# Altium project ESP32C3PHILS.PrjPcb
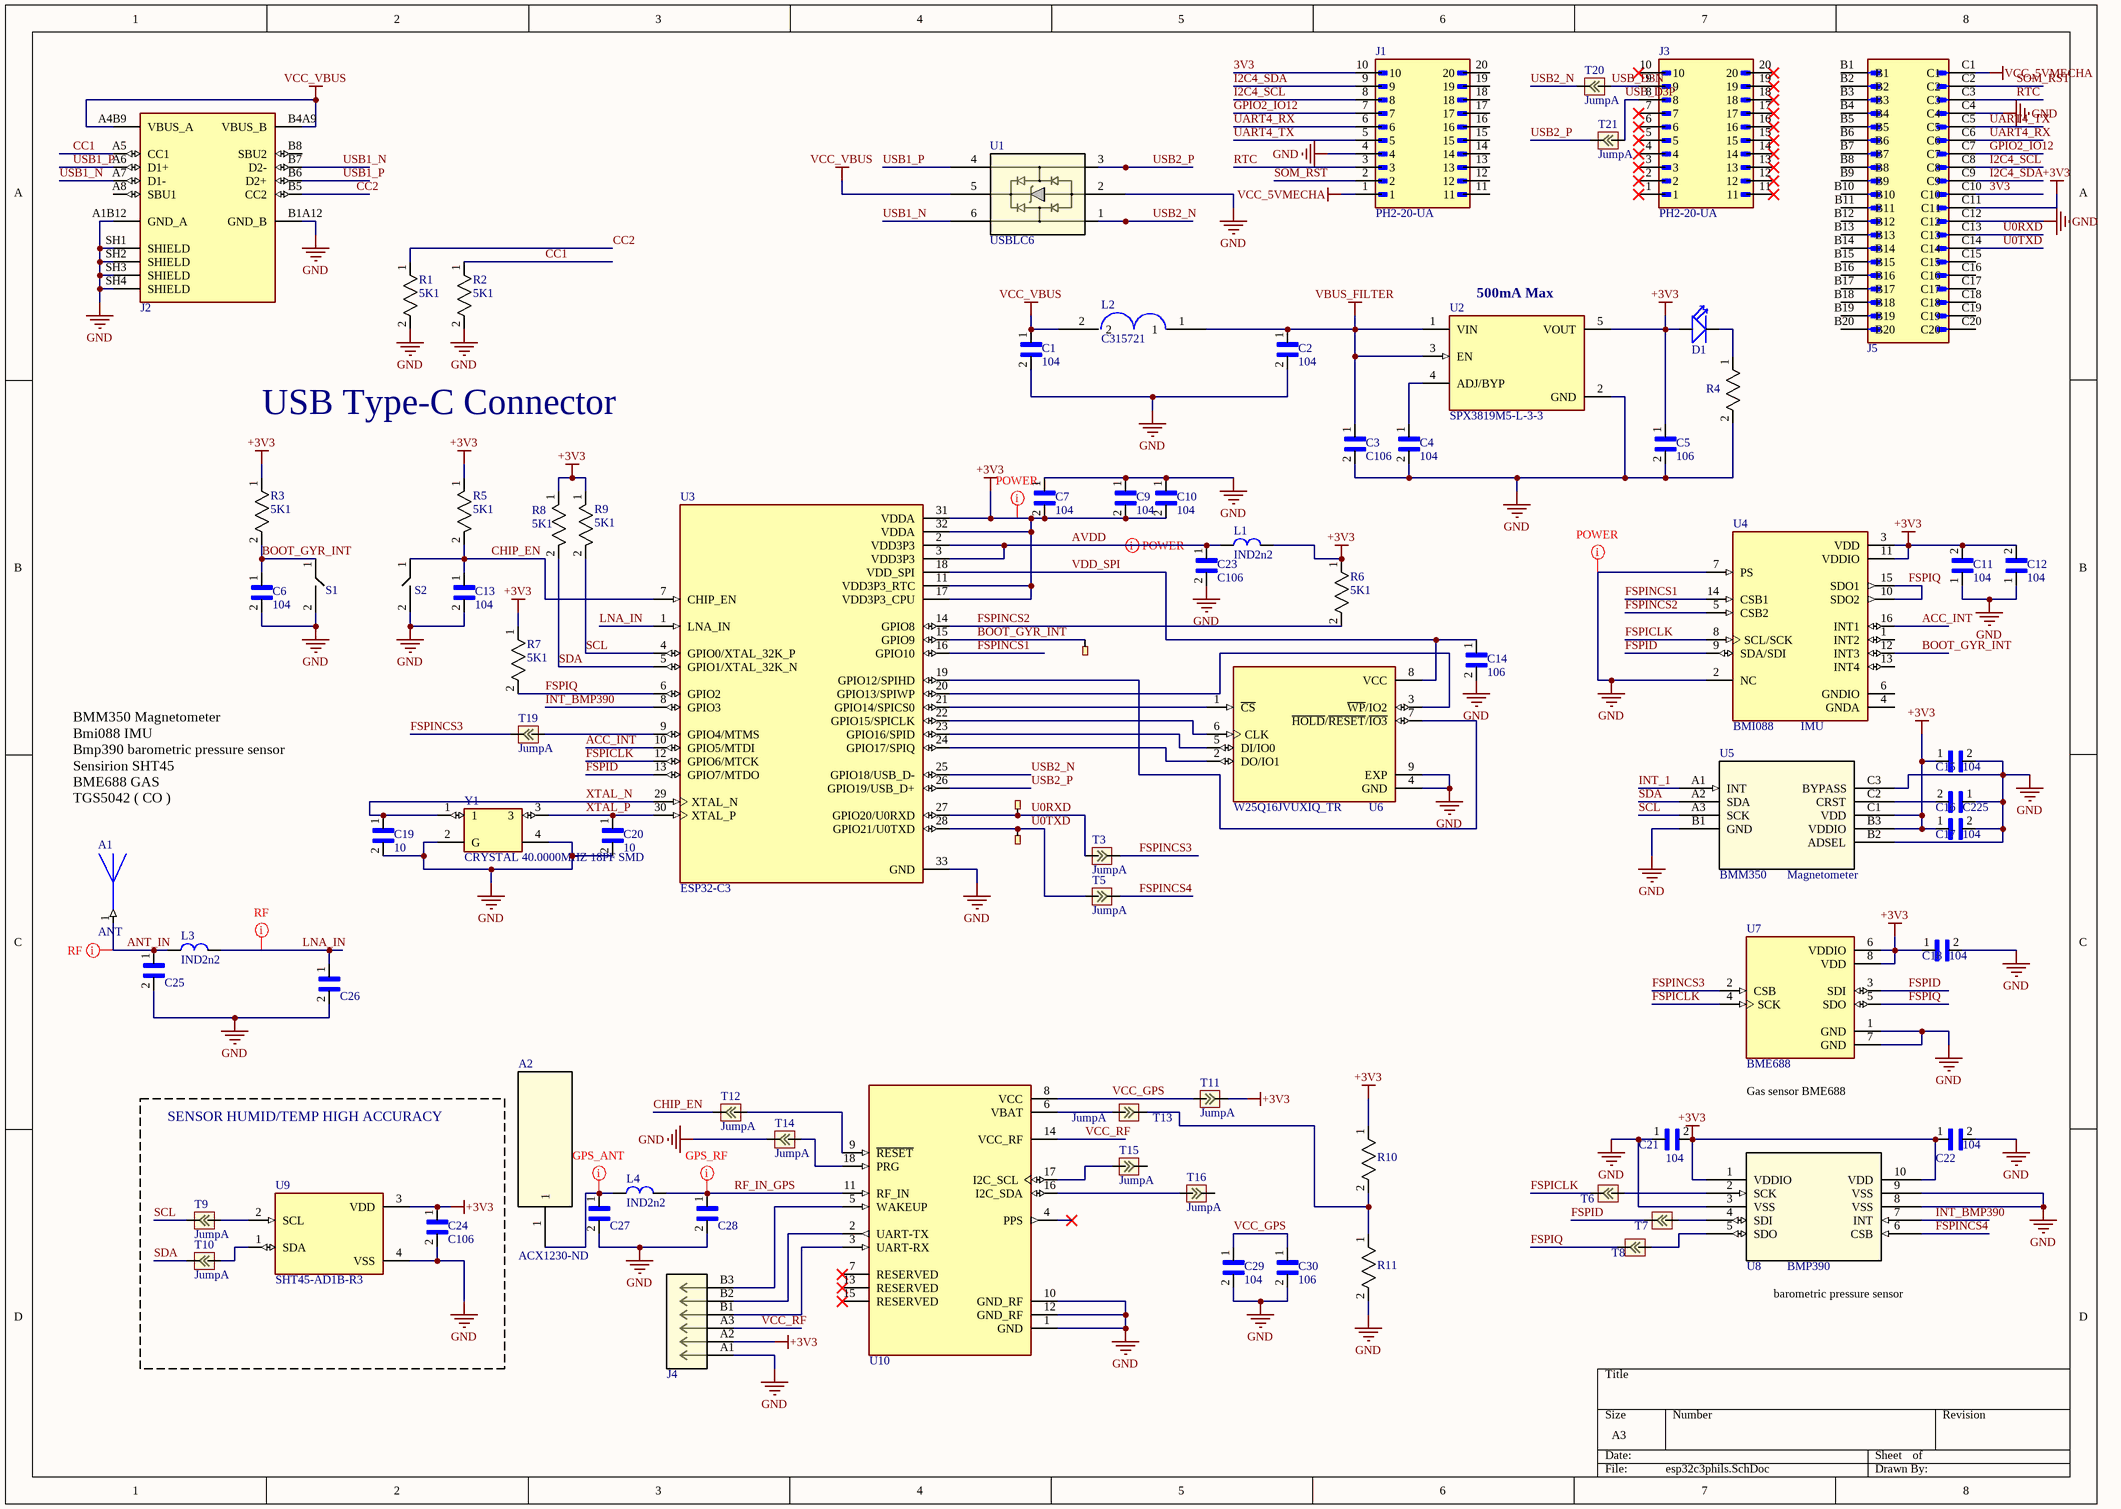
[diagram p0: esp32c3phils.SchDoc]
1 sheet, 84 parts. Net scope: global (net labels, ports and power ports of the same name join across sheets).
Board files: esp32c3phils.PcbDoc, PCB_mecha-io-extension_2025-06-03.pcbdoc

## Sheet esp32c3phils.SchDoc
size A3; SheetNumber: 1; SheetTotal: 1

### Parts
A1  ANT  [XDCR_AMCA31-2R450G-S1F-T3]
A2  Supplier Part Number 1: ACX1230-ND  [SMA_VERTICAL]  (hidden comment: SMA_VERTICAL)
C1  104  [CAPC1005X55N2]
C2  104  [CAPC1005X55N2]
C3  C106  [RC0402]
C4  104  [CAPC1005X55N2]
C5  106  [RC0402]
C6  104  [CAPC1005X55N2]
C7  104  [CAPC1005X55N2]
C9  104  [CAPC1005X55N2]
C10  104  [CAPC1005X55N2]
C11  104  [CAPC1005X55N2]
C12  104  [CAPC1005X55N2]
C13  104  [CAPC1005X55N2]
C14  106  [RC0402]
C15  104  [CAPC1005X55N2]
C16  C225  [RC0402X]
C17  104  [CAPC1005X55N2]
C18  104  [CAPC1005X55N2]
C19  10  [RC0402]
C20  10  [RC0402]
C21  104  [CAPC1005X55N2]
C22  104  [CAPC1005X55N2]
C23  C106  [RC0402]
C24  C106  [RC0402]
C25  GJM1555C1H3R3BB01D  [RC0402]  (value not drawn)
C26  GJM1555C1H3R3BB01D  [RC0402]  (value not drawn)
C27  GJM1555C1H3R3BB01D  [RC0402]  (value not drawn)
C28  GJM1555C1H3R3BB01D  [RC0402]  (value not drawn)
C29  104  [CAPC1005X55N2]
C30  106  [RC0402]
D1  LED  [LEDM1608X80]  (value not drawn)
J1  PH2-20-UA  [HEADERPAD_20_80MIL]
J2  GSB1C411111DS1HR  [AMPHENOL_GSB1C411111DS1HR]  (value not drawn)
J3  PH2-20-UA  [HEADERPAD_20_80MIL]
J4  HEADER6PIN2.54  [HEADER6PIN2.54]  (value not drawn)
J5  HEADER_40PIN_SMD  [AMPHENOL_95157-440LF]  (value not drawn)
L1  IND2n2  [INDC1006X60N]
L2  C315721  [IND-SMD_L2.5-W2.0_SWPA252012S]
L3  IND2n2  [INDC1006X60N]
L4  IND2n2  [INDC1006X60N]
R1  5K1  [RC0402]
R2  5K1  [RC0402]
R3  5K1  [RC0402]
R4  ERA-2AEB202X  [RC0402X]  (value not drawn)
R5  5K1  [RC0402]
R6  5K1  [RC0402]
R7  5K1  [RC0402]
R8  5K1  [RC0402]
R9  5K1  [RC0402]
R10  15K0402  [RC0402X]  (value not drawn)
R11  33K0402  [RC0402X]  (value not drawn)
S1  SW_P  [SW]  (value not drawn)
S2  SW_P  [SW]  (value not drawn)
T1  TP  [TP]  (value not drawn)
T2  TP  [TP]  (value not drawn)
T3  JumpA  [JumpA]
T4  TP  [TP]  (value not drawn)
T5  JumpA  [JumpA]
T6  JumpA  [JumpA]  (value not drawn)
T7  JumpA  [JumpA]  (value not drawn)
T8  JumpA  [JumpA]  (value not drawn)
T9  JumpA  [JumpA]
T10  JumpA  [JumpA]
T11  JumpA  [JumpA]
T12  JumpA  [JumpA]
T13  JumpA  [JumpA]
T14  JumpA  [JumpA]
T15  JumpA  [JumpA]
T16  JumpA  [JumpA]
T19  JumpA  [JumpA]
T20  JumpA  [JumpA]
T21  JumpA  [JumpA]
U1  USBLC6  [SOT23-6L_STM]
U2  SPX3819M5-L-3-3  [SOT95P280X145-5N]
U3  ESP32-C3  [QFN50P500X500X90-33N]
U4  BMI088  [PQFN50P450X300X100-16N]
U5  BMM350  [BGA9_BMM350_BOS]
U6  W25Q16JVUXIQ_TR  [IC_W25Q16JVUXIQ_TR]
U7  BME688  [IC_BME688]
U8  BMP390  [10LGA_2X2X0p75_BOS]
U9  SHT45-AD1B-R3  [SHT4X]
U10  TESEO-LIV4FTR  [XCVR_TESEO-LIV4FTR]  (value not drawn)
Y1  CRYSTAL 40.0000MHZ 18PF SMD  [XTAL_ECS-400-18-33-JGN-TR3]

### Blocks framed on the sheet
SENSOR HUMID/TEMP HIGH ACCURACY: C24 T9 T10 U9

### Nets
+3V3: C5.1 C7.2 C9.2 C10.2 C11.2 C12.2 C15.1 C17.1 C18.1 C21.2 C22.1 C24.1 D1.A J4.A2 J5.C11 L1.2 R3.1 R5.1 R6.1 R7.1 R8.1 R9.1 R10.1 T11.2 U2.5(VOUT) U3.11(VDD3P3_RTC) U3.17(VDD3P3_CPU) U3.31(VDDA) U3.32(VDDA) U4.3(VDD) U4.11(VDDIO) U5.B3(VDDIO) U5.C1(VDD) U7.6(VDDIO) U7.8(VDD) U8.1(VDDIO) U8.10(VDD) U9.3(VDD)
GND: C1.2 C2.2 C3.2 C4.2 C5.2 C6.2 C7.1 C9.1 C10.1 C11.1 C12.1 C13.2 C14.2 C15.2 C16.1 C17.2 C18.2 C19.2 C20.2 C21.1 C22.2 C23.2 C24.2 C25.2 C26.2 C27.2 C28.2 C29.2 C30.2 J1.4 J2.A1B12(GND_A) J2.B1A12(GND_B) J2.SH1(SHIELD) J2.SH2(SHIELD) J2.SH3(SHIELD) J2.SH4(SHIELD) J4.A1 J5.C4 J5.C12 R1.2 R2.2 R4.2 R11.2 S1.2 S2.2 T14.2 U1.2 U2.2(GND) U3.33(GND) U4.2(NC) U4.7(PS) U5.B1(GND) U5.B2(ADSEL) U5.C3(BYPASS) U6.4(GND) U6.9(EXP) U7.1(GND) U7.7(GND) U8.3(VSS) U8.8(VSS) U8.9(VSS) U9.4(VSS) U10.1(GND) U10.10(GND_RF) U10.12(GND_RF) Y1.2(G) Y1.4(G)
VBUS_FILTER: C2.1 C3.1 L2.1 U2.1(VIN) U2.3(EN)
VCC_5VMECHA: J1.1 J5.C1
VCC_VBUS: C1.1 J2.A4B9(VBUS_A) J2.B4A9(VBUS_B) L2.2 U1.5
3V3: J1.10 J5.C10
ACC_INT: U3.10(GPIO5/MTDI) U4.16(INT1)
ANT_IN: A1.1 C25.1 L3.1
AVDD: C23.1 L1.1 U3.2(VDD3P3) U3.3(VDD3P3)
BOOT_GYR_INT: C6.1 R3.2 S1.1 T1.1 U3.15(GPIO9) U4.12(INT3)
CC1: J2.A5(CC1) R2.1
CC2: J2.B5(CC2) R1.1
CHIP_EN: C13.1 R5.2 S2.1 T12.2 U3.7(CHIP_EN)
FSPICLK: T6.2 U3.12(GPIO6/MTCK) U4.8(SCL/SCK) U7.4(SCK)
FSPID: T7.2 U3.13(GPIO7/MTDO) U4.9(SDA/SDI) U7.3(SDI)
FSPINCS1: U3.16(GPIO10) U4.14(CSB1)
FSPINCS2: R6.2 U3.14(GPIO8) U4.5(CSB2)
FSPINCS3: T3.2 T19.2 U7.2(CSB)
FSPINCS4: T5.2 U8.6(CSB)
FSPIQ: R7.2 T8.2 U3.6(GPIO2) U4.10(SDO2) U4.15(SDO1) U7.5(SDO)
GPIO2_IO12: J1.7 J5.C7
I2C4_SCL: J1.8 J5.C8
I2C4_SDA: J1.9 J5.C9
INT_1: U5.A1(INT)
INT_BMP390: U3.8(GPIO3) U8.7(INT)
LNA_IN: C26.1 L3.2 U3.1(LNA_IN)
RF_IN_GPS: C28.1 L4.2 U10.11(RF_IN)
RTC: J1.3 J5.C3
SCL: R9.2 T9.2 U3.4(GPIO0/XTAL_32K_P) U5.A3(SCK)
SDA: R8.2 T10.2 U3.5(GPIO1/XTAL_32K_N) U5.A2(SDA)
SOM_RST: J1.2 J5.C2
U0RXD: J5.C13 T2.1 T3.1 U3.27(GPIO20/U0RXD)
U0TXD: J5.C14 T4.1 T5.1 U3.28(GPIO21/U0TXD)
UART4_RX: J1.6 J5.C6
UART4_TX: J1.5 J5.C5
USB1_N: J2.A7(D1-) J2.B7(D2-) U1.6
USB1_P: J2.A6(D1+) J2.B6(D2+) U1.4
USB2_N: T20.2 U1.1 U3.25(GPIO18/USB_D-)
USB2_P: T21.2 U1.3 U3.26(GPIO19/USB_D+)
USB_D3N: J3.9 T20.1
USB_D3P: J3.8 T21.1
VCC_GPS: C29.1 C30.1 T11.1 U10.8(VCC)
VCC_RF: J4.A3 U10.14(VCC_RF)
VDD_SPI: C14.1 U3.18(VDD_SPI) U6.8(VCC)
XTAL_N: C19.1 U3.29(XTAL_N) Y1.1
XTAL_P: C20.1 U3.30(XTAL_P) Y1.3
NetA2_1: A2.1 C27.1 L4.1
NetC4_1: C4.1 U2.4(ADJ/BYP)
NetC16_2: C16.2 U5.C2(CRST)
NetD1_C: D1.C R4.1
NetJ4_B1: J4.B1 U10.3(UART-RX)
NetJ4_B2: J4.B2 U10.2(UART-TX)
NetJ4_B3: J4.B3 U10.5(WAKEUP)
NetR10_2: R10.2 R11.1 T13.2
NetT6_1: T6.1 U8.2(SCK)
NetT7_1: T7.1 U8.4(SDI)
NetT8_1: T8.1 U8.5(SDO)
NetT9_1: T9.1 U9.2(SCL)
NetT10_1: T10.1 U9.1(SDA)
NetT12_1: T12.1 U10.9(~{RESET})
NetT13_1: T13.1 U10.6(VBAT)
NetT14_1: T14.1 U10.18(PRG)
NetT15_1: T15.1 U10.17(I2C_SCL)
NetT16_1: T16.1 U10.16(I2C_SDA)
NetT19_1: T19.1 U3.9(GPIO4/MTMS)
NetU3_19: U3.19(GPIO12/SPIHD) U6.7(~{HOLD}/~{RESET}/~{IO3})
NetU3_20: U3.20(GPIO13/SPIWP) U6.3(~{WP}/IO2)
NetU3_21: U3.21(GPIO14/SPICS0) U6.1(~{CS})
NetU3_22: U3.22(GPIO15/SPICLK) U6.6(CLK)
NetU3_23: U3.23(GPIO16/SPID) U6.5(DI/IO0)
NetU3_24: U3.24(GPIO17/SPIQ) U6.2(DO/IO1)

Not connected (* = marked no-connect by the designer): J1 11 12 13 14 15 16 17 18 19 20; J2 A8(SBU1) B8(SBU2); J3 1* 2* 3* 4* 5* 6* 7* 10* 11* 12* 13* 14* 15* 16* 17* 18* 19* 20*; J5 B1 B2 B3 B4 B5 B6 B7 B8 B9 B10 B11 B12 B13 B14 B15 B16 B17 B18 B19 B20 C15 C16 C17 C18 C19 C20; T15 2; T16 2; U4 1(INT2) 4(GNDA) 6(GNDIO) 13(INT4); U10 4(PPS)* 7(RESERVED)* 13(RESERVED)* 15(RESERVED)*

### Layout directives
net class RF: ANT_IN, LNA_IN
net class POWER: +3V3, AVDD, GND
mark named GPS_ANT: NetA2_1
mark named GPS_RF: RF_IN_GPS

### Notes on the sheet
- (near U2) 500mA Max
- USB Type-C Connector
- (near U4) IMU
- BMM350 Magnetometer
  Bmi088 IMU
  Bmp390 barometric pressure sensor
  Sensirion SHT45
  BME688 GAS
  TGS5042 ( CO )
- (near U5) Magnetometer
- (near U7) Gas sensor BME688
- (near U8) barometric pressure sensor

### Library data of the parts
A1 = AMCA31-2R450G-S1F-T3: Chip Dielectric Antenna; 1dBi; 2450MHz; T/R | Abracon AMCA31-2R450G-S1F-T3; Manufacturer Part Number: C3283994; Impedance: 50R; Frequency: 2.45GHz; Bandwidth: 90MHz; Power Rating: 3W; Number of Bands: 1; VSWR: 2; Supplier 1: Digikey; Manufacturer: Abracon; RoHS: Yes; Category: RF Antennas; Stock 1: 40750; Pricing 1: 1=0.31, 10=0.217, 25=0.1924, 100=0.1875, 250=0.18412, 500=0.17502, 1000=0.15693 (USD); Mount: Surface Mount; Case/Package: SMD/SMT; Packaging: Tape and Reel; Package Quantity: 3000; Max Power Dissipation: 3W; Termination: Solder; Max Frequency: 2.45GHz; Series: AMCA; Height: 0.047inch; RoHS Compliant: Yes; ComponentLink1URL: https://datasheet.ciiva.com/29647/amca31-2r450g-s1f-t-29647350.pdf?src-supplier=Digikey; ComponentLink1Description: https://datasheet.ciiva.com/29647/amca31-2r450g-s1f-t-29647350.pdf?src-supplier=Digikey; Supplier Part Number 1: 535-14095-1-ND
A2 = SMA_VERTICAL: connector, rf coaxial, sma str jack for p.c.board, 4 legs, .050 center cont, 50 ohm; Manufacturer: Amphenol Connex; Manufacturer Part Number: C3174425; Number of Contacts: 1NUMBER; Supplier 1: Digikey; RoHS: Yes; Category: RF / Coaxial Connectors; Stock 1: 8757; Pricing 1: 1=5.97, 10=5.52, 25=5.362, 50=4.965, 100=4.5941, 300=4.48817, 500=3.66732, 2500=3.43802 (USD); Lead Free: 5697LeadFree; ComponentLink1URL: https://datasheet.ciiva.com/644/132134-644417.pdf?src-supplier=Digikey; ComponentLink1Description: https://datasheet.ciiva.com/644/132134-644417.pdf?src-supplier=Digikey; ComponentLink2URL: https://datasheet.ciiva.com/1118/132134-customer-drawing-1118290.pdf?src-supplier=Newark; ComponentLink2Description: https://datasheet.ciiva.com/1118/132134-customer-drawing-1118290.pdf?src-supplier=Newark; ComponentLink3URL: https://datasheet.ciiva.com/24472/132134-24472891.pdf?src-supplier=Onlinecomponents.com; ComponentLink3Description: https://datasheet.ciiva.com/24472/132134-24472891.pdf?src-supplier=Onlinecomponents.com; ComponentLink4URL: https://datasheet.ciiva.com/8045/1510247-8045022.pdf?src-supplier=Element14; ComponentLink4Description: https://datasheet.ciiva.com/8045/1510247-8045022.pdf?src-supplier=Element14; ComponentLink5URL: https://datasheet.ciiva.com/1116/1510247-1116395.pdf?src-supplier=Element14; ComponentLink5Description: https://datasheet.ciiva.com/1116/1510247-1116395.pdf?src-supplier=Element14; ComponentLink6URL: https://datasheet.ciiva.com/14568/70031837-14568710.pdf?src-supplier=Allied+Electronics; ComponentLink6Description: https://datasheet.ciiva.com/14568/70031837-14568710.pdf?src-supplier=Allied+Electronics
C1 C2 C4 C6 C7 C9-C13 C15 C17 C18 C21 C22 C29 = CC0402KRX7R7BB104: Multilayer Ceramic Capacitor, 0.1 uF, 16 V, ï¿½ 10%, X7R, 0402 [1005 Metric]; Manufacturer: Yageo; Material: 4241ConductorMaterial; Capacitance: 100nF; Voltage Rating: 16V; Temperature Coefficient: 30ppm/°C; Supplier 1: Digikey; Manufacturer Part Number: CC0402KRX7R7BB104; RoHS: Yes; Category: Ceramic Capacitors; Stock 1: 15609894; Pricing 1: 1=0.1, 10=0.024, 50=0.0164, 100=0.0139, 500=0.0098, 1000=0.00852, 2500=0.00718, 5000=0.00636 (USD); Mount: Surface Mount; Case/Package: 0402; Number of Pins: 2; Case Code (Metric): 1005; Case Code (Imperial): 0402; Min Operating Temperature: -55°C; Max Operating Temperature: 125°C; Tolerance: 10%; Voltage Rating (DC): 16V; Packaging: Tape and Reel; Package Quantity: 1; Dielectric: X7R; Termination: SMD/SMT; Voltage: 16V; Series: CC; Voltage Rating (AC): 16V; Length: 1mm; Width: 0.02inch; Height: 0.5mm; Thickness: 0.022inch; Depth: 0.5mm; Radiation Hardening: No; Reach SVHC Compliant: No; RoHS Compliant: Yes; Halogen Free: 5694HalogenFree; Lead Free: 5697LeadFree; ComponentLink1URL: https://datasheet.ciiva.com/11788/0900766b80ce67ed-11788364.pdf?src-supplier=Rs; ComponentLink1Description: https://datasheet.ciiva.com/11788/0900766b80ce67ed-11788364.pdf?src-supplier=Rs; ComponentLink2URL: https://datasheet.ciiva.com/7978/1489800-7978111.pdf?src-supplier=Element14; ComponentLink2Description: https://datasheet.ciiva.com/7978/1489800-7978111.pdf?src-supplier=Element14; ComponentLink3URL: https://datasheet.ciiva.com/161/mlccorderingcode-161545.pdf?src-supplier=Digikey; ComponentLink3Description: https://datasheet.ciiva.com/161/mlccorderingcode-161545.pdf?src-supplier=Digikey; ComponentLink4URL: https://datasheet.ciiva.com/161/mlccorderingcode-161544.pdf?src-supplier=Digikey; ComponentLink4Description: https://datasheet.ciiva.com/161/mlccorderingcode-161544.pdf?src-supplier=Digikey; ComponentLink5URL: https://datasheet.ciiva.com/161/mlccorderingcode-161546.pdf?src-supplier=Digikey; ComponentLink5Description: https://datasheet.ciiva.com/161/mlccorderingcode-161546.pdf?src-supplier=Digikey; ComponentLink6URL: https://datasheet.ciiva.com/8033/1734573-8033661.pdf?src-supplier=Element14; ComponentLink6Description: https://datasheet.ciiva.com/8033/1734573-8033661.pdf?src-supplier=Element14; ComponentLink7URL: https://datasheet.ciiva.com/11587/upy-gphc-x7r-6-3v-to-50v-8-11587305.pdf?src-supplier=Avnet; ComponentLink7Description: https://datasheet.ciiva.com/11587/upy-gphc-x7r-6-3v-to-50v-8-11587305.pdf?src-supplier=Avnet; LCSC: C60474; Supplier Part Number 1: 311-1338-1-ND
C3 C5 C14 C23 C24 C30 = 0402ZD106MAT2A: Multilayer Ceramic Chip Capacitor 0402 Size 10uF 10V X5R ±20% Tolerance SMD T/R; Manufacturer: Kyocera AVX; Manufacturer Part Number: C2167902; Material: 4241ConductorMaterial; Supplier 1: Digikey; RoHS: Yes; Category: Ceramic Capacitors; Stock 1: 61749; Pricing 1: 1=0.36, 10=0.212, 100=0.1271, 1000=0.0834, 2500=0.07583 (USD); Mount: Surface Mount; Case/Package: 0402; Case Code (Imperial): 0402; Case Code (Metric): 1005; Min Operating Temperature: -55°C; Max Operating Temperature: 85°C; Series: -; Packaging: Cut Tape; Dielectric: X5R; Voltage Rating (DC): 10V; Capacitance: 10uF; Tolerance: 20%; Voltage Rating: 10V; Height: 710um; RoHS Compliant: Yes; ComponentLink1URL: http://catalogs.avx.com/SurfaceMount.pdf?src-supplier=Digikey; ComponentLink1Description: http://catalogs.avx.com/SurfaceMount.pdf?src-supplier=Digikey; ComponentLink2URL: http://datasheets.avx.com/cx5r.pdf?src-supplier=Digikey; ComponentLink2Description: http://datasheets.avx.com/cx5r.pdf?src-supplier=Digikey; ComponentLink3URL: https://datasheet.octopart.com/0402ZD106MAT2A-KYOCERA-AVX-datasheet-155912759.pdf?src-supplier=Future+Electronics; ComponentLink3Description: https://datasheet.octopart.com/0402ZD106MAT2A-KYOCERA-AVX-datasheet-155912759.pdf?src-supplier=Future+Electronics; ComponentLink4URL: https://www.farnell.com/datasheets/2260752.pdf?src-supplier=Newark; ComponentLink4Description: https://www.farnell.com/datasheets/2260752.pdf?src-supplier=Newark; ComponentLink5URL: https://datasheet.octopart.com/0402ZD106MAT2A-KYOCERA-AVX-datasheet-155912759.pdf?src-supplier=TME; ComponentLink5Description: https://datasheet.octopart.com/0402ZD106MAT2A-KYOCERA-AVX-datasheet-155912759.pdf?src-supplier=TME; Supplier Part Number 1: 478-KGM05CR51A106MHCT-ND
C16 = C225: Multilayer Ceramic Capacitor, 2.2 uF, 6.3 V, ï¿½ 20%, X5R, 0402 [1005 Metric]; Manufacturer: Samsung; Manufacturer Part Number: CL05A225MQ5NNNC; Capacitance: 2.2uF; Voltage Rating: 6.3V; Supplier 1: Digikey; RoHS: Yes; Category: Ceramic Capacitors; Stock 1: 23507; Pricing 1: 1=0.08, 10=0.011, 100=0.0064, 1000=0.0048, 2500=0.0032 (USD); Mount: Surface Mount; Case/Package: 0402; Case Code (Metric): 1005; Case Code (Imperial): 0402; Material: Ceramic; Min Operating Temperature: -55°C; Max Operating Temperature: 85°C; Packaging: Tape and Reel; Tolerance: 20%; Dielectric: X5R; Series: CL; Construction: Flat; Voltage Rating (DC): 6.3V; Length: 1mm; Height: 0.5mm; Depth: 0.5mm; Radiation Hardening: No; RoHS Compliant: Yes; ComponentLink1URL: https://datasheet.ciiva.com/25798/cl05a225mq5nnnc-25798545.pdf?src-supplier=Digikey; ComponentLink1Description: https://datasheet.ciiva.com/25798/cl05a225mq5nnnc-25798545.pdf?src-supplier=Digikey; ComponentLink2URL: https://datasheet.ciiva.com/16437/cl05a225mq5nnnc-16437362.pdf?src-supplier=Future+Electronics; ComponentLink2Description: https://datasheet.ciiva.com/16437/cl05a225mq5nnnc-16437362.pdf?src-supplier=Future+Electronics; Supplier Part Number 1: 1276-1469-1-ND
C19 C20 = C10: 0402 10 pF 50 V ±5 % Tolerance NP0 SMT Multilayer Ceramic Capacitor; Manufacturer: Yageo; Manufacturer Part Number: CC0402JRNPO9BN100; Dielectric Material: 4241ConductorMaterial; Capacitance: 10pF; Tolerance: 5%; Voltage Rating: 50V; Dielectric: C0G; Temperature Coefficient: 30ppm/°C; Insulation Resistance: 100GR; Supplier 1: Digikey; RoHS: Yes; Category: Ceramic Capacitors; Stock 1: 1109319; Pricing 1: 1=0.1, 10=0.024, 100=0.0133, 1000=0.00812, 2500=0.00685, 5000=0.00609 (USD); Mount: Surface Mount; Case/Package: 0402; Number of Pins: 2; Case Code (Metric): 1005; Case Code (Imperial): 0402; Min Operating Temperature: -55°C; Max Operating Temperature: 125°C; Packaging: Tape and Reel; Voltage Rating (DC): 50V; Package Quantity: 1; Termination: SMD/SMT; Voltage: 50V; Series: CC; Voltage Rating (AC): 50V; Length: 1mm; Width: 0.02inch; Height: 0.5mm; Thickness: 0.022inch; Depth: 0.5mm; Radiation Hardening: No; Reach SVHC Compliant: No; Lead Free: Lead Free; RoHS Compliant: Yes; Halogen Free: 5694HalogenFree; ComponentLink1URL: https://datasheet.ciiva.com/11786/0900766b8079c870-11786158.pdf?src-supplier=Rs; ComponentLink1Description: https://datasheet.ciiva.com/11786/0900766b8079c870-11786158.pdf?src-supplier=Rs; ComponentLink2URL: https://datasheet.ciiva.com/143/mlccorderingcode-143992.pdf?src-supplier=Digikey; ComponentLink2Description: https://datasheet.ciiva.com/143/mlccorderingcode-143992.pdf?src-supplier=Digikey; ComponentLink3URL: https://datasheet.ciiva.com/143/mlccorderingcode-143993.pdf?src-supplier=Digikey; ComponentLink3Description: https://datasheet.ciiva.com/143/mlccorderingcode-143993.pdf?src-supplier=Digikey; ComponentLink4URL: https://datasheet.ciiva.com/143/mlccorderingcode-143994.pdf?src-supplier=Digikey; ComponentLink4Description: https://datasheet.ciiva.com/143/mlccorderingcode-143994.pdf?src-supplier=Digikey; ComponentLink5URL: https://datasheet.ciiva.com/8033/1443161-8033591.pdf?src-supplier=Element14; ComponentLink5Description: https://datasheet.ciiva.com/8033/1443161-8033591.pdf?src-supplier=Element14; ComponentLink6URL: https://datasheet.ciiva.com/8033/1443161-8033593.pdf?src-supplier=Element14; ComponentLink6Description: https://datasheet.ciiva.com/8033/1443161-8033593.pdf?src-supplier=Element14; ComponentLink7URL: https://datasheet.ciiva.com/8033/1443161-8033596.pdf?src-supplier=Element14; ComponentLink7Description: https://datasheet.ciiva.com/8033/1443161-8033596.pdf?src-supplier=Element14; ComponentLink8URL: https://datasheet.ciiva.com/28450/1443161-28450213.pdf?src-supplier=Element14; ComponentLink8Description: https://datasheet.ciiva.com/28450/1443161-28450213.pdf?src-supplier=Element14; ComponentLink9URL: https://datasheet.ciiva.com/5427/upy-gp-np0-16v-to-50v-8-5427741.pdf?src-supplier=Mouser; ComponentLink9Description: https://datasheet.ciiva.com/5427/upy-gp-np0-16v-to-50v-8-5427741.pdf?src-supplier=Mouser; Supplier Part Number 1: 311-1014-1-ND
C25-C28 = 3.3PF0402LCSC: Multilayer Ceramic Capacitors MLCC - SMD/SMT 0402 3.3pF 50Volts C0G +/-0.1pF; Manufacturer: Murata; Manufacturer Part Number: C76906; Voltage Rating: 50V; Temperature Coefficient: 30ppm/°C; Supplier 1: Digikey; RoHS: Yes; Category: Ceramic Capacitors; Stock 1: 2577; Pricing 1: 1=0.12, 10=0.065, 100=0.039, 1000=0.02419, 2500=0.02076, 5000=0.02051 (USD); Mount: Surface Mount; Case/Package: 0402; Number of Pins: 2; Case Code (Metric): 1005; Case Code (Imperial): 0402; Material: Ceramic; Min Operating Temperature: -55°C; Max Operating Temperature: 125°C; Capacitance: 3.3pF; Package Quantity: 1; Packaging: Tape and Reel; Voltage Rating (DC): 50V; Dielectric: C0G; Termination: SMD/SMT; Voltage: 50V; Series: GJM; Construction: Flat; Length: 1mm; Width: 0.5mm; Height: 0.5mm; Thickness: 0.022inch; Depth: 0.5mm; Lead Pitch: 0.3mm; Radiation Hardening: No; Reach SVHC Compliant: No; Lead Free: Lead Free; RoHS Compliant: Yes; ComponentLink1URL: https://datasheet.ciiva.com/11614/product-11614199.pdf?src-supplier=Avnet; ComponentLink1Description: https://datasheet.ciiva.com/11614/product-11614199.pdf?src-supplier=Avnet; ComponentLink2URL: https://datasheet.ciiva.com/8030/1700175-8030120.pdf?src-supplier=Element14; ComponentLink2Description: https://datasheet.ciiva.com/8030/1700175-8030120.pdf?src-supplier=Element14; Supplier Part Number 1: 490-8097-1-ND
D1 = LTST-C190KFKT: Single Color LED, Ultra Bright Orange, Water Clear, 1.1mm; Manufacturer: Vishay Lite-On; Manufacturer Part Number: C157740; Lens Color: Colorless; Power Rating: 75mW; Luminous Intensity: 90mcd; Viewing Angle: 130°; Forward Current: 30mA; Forward Voltage: 2V; Lens Style: Flat,Diffused,Colorless,Rectangular,Clear; Dominant Wavelength: 605nm; Test Current: 20mA; Number of Elements: 1; Reverse Voltage: 5V; Voltage Rating: 50V; Resistance: 47kR; Tolerance: 1%; Lens Size: 0.8mm; Supplier 1: Digikey; RoHS: Yes; Category: LEDs; Stock 1: 96032; Pricing 1: 1=0.13, 10=0.089, 100=0.0613, 500=0.0484, 1000=0.0441, 2000=0.04042 (USD); Mount: Surface Mount; Case/Package: 0603; Number of Pins: 2; Color: Orange; Case Code (Metric): 1608; Case Code (Imperial): 0603; Min Operating Temperature: -55°C; Max Operating Temperature: 85°C; Packaging: Tape and Reel; Package Quantity: 3000; Illumination Color: Orange; Lens Transparency: Clear; Power Dissipation: 75mW; Wavelength: 605nm; Number of LEDs: 1; Series: -; Voltage Rating (DC): 50V; Length: 3.2mm; Width: 0.8mm; Height: 0.9mm; Depth: 1.6mm; Radiation Hardening: No; Lead Free: Lead Free; RoHS Compliant: Yes; Reach SVHC Compliant: 4186SVHC; ComponentLink1URL: https://datasheet.ciiva.com/11774/0900766b80dc02a7-11774744.pdf?src-supplier=Rs; ComponentLink1Description: https://datasheet.ciiva.com/11774/0900766b80dc02a7-11774744.pdf?src-supplier=Rs; ComponentLink2URL: https://datasheet.ciiva.com/15201/getdatasheetpartid-309341-15201388.pdf?src-supplier=Verical; ComponentLink2Description: https://datasheet.ciiva.com/15201/getdatasheetpartid-309341-15201388.pdf?src-supplier=Verical; ComponentLink3URL: https://datasheet.ciiva.com/16396/lite-on20ltst-c190kfkt-16396246.pdf?src-supplier=Future+Electronics; ComponentLink3Description: https://datasheet.ciiva.com/16396/lite-on20ltst-c190kfkt-16396246.pdf?src-supplier=Future+Electronics; ComponentLink4URL: https://datasheet.ciiva.com/12400/100-ltst-c190kfkt-53640-12400769.pdf?src-supplier=Mouser; ComponentLink4Description: https://datasheet.ciiva.com/12400/100-ltst-c190kfkt-53640-12400769.pdf?src-supplier=Mouser; ComponentLink5URL: https://datasheet.ciiva.com/2109/s-110-ltst-c190kfkt-2109976.pdf?src-supplier=Digikey; ComponentLink5Description: https://datasheet.ciiva.com/2109/s-110-ltst-c190kfkt-2109976.pdf?src-supplier=Digikey; ComponentLink6URL: https://datasheet.ciiva.com/2109/s-110-ltst-c190kfkt-2109977.pdf?src-supplier=Digikey; ComponentLink6Description: https://datasheet.ciiva.com/2109/s-110-ltst-c190kfkt-2109977.pdf?src-supplier=Digikey; ComponentLink7URL: https://datasheet.ciiva.com/2109/s-110-ltst-c190kfkt-2109978.pdf?src-supplier=Digikey; ComponentLink7Description: https://datasheet.ciiva.com/2109/s-110-ltst-c190kfkt-2109978.pdf?src-supplier=Digikey; Supplier Part Number 1: 160-1434-1-ND
J1 J3 = PH2-20-UA: MF: {'manufacturer': u'Adam Tech'}; Package: None; Price: None; Value: *; MP: PH2-20-UA; Availability: Unavailable
J2 = USB-C RECP B: USB2.0, Type C, Top mount, Center Height 1.68mm, Single Row Surface Mount; Manufacturer: Amphenol; Supplier 1: Digikey; Manufacturer Part Number: GSB1C411111DS1HR; RoHS: No; Category: Connectors; Stock 1: 7439; Pricing 1: 1=0.81, 10=0.686, 25=0.6428, 50=0.6122, 100=0.5829, 250=0.54632, 500=0.52024 (USD); Supplier Part Number 1: 664-GSB1C411111DS1HRCT-ND; LCSC Part#: C3197888
J4 = HEADER6PIN2.54: Conn Unshrouded Header HDR 6 POS 2.54mm Solder ST Top Entry SMD C-Grid Bag; Manufacturer: Molex; Manufacturer Part Number: C780054; Plating: Tin; Max Voltage Rating (DC): 250.25kV; Current Rating: 3A; Voltage Rating: 250V; Number of Positions: 6; Gender: Male; Number of Circuits: 4; Glow Wire Compliant: Non-compliant; Supplier 1: Digikey; RoHS: Yes; Category: Headers and Wire Housings; Stock 1: 16474; Pricing 1: 1=0.52, 10=0.445, 100=0.3781, 500=0.33748, 3000=0.29738, 6000=0.28319, 12000=0.26968 (USD); Mount: Surface Mount; Contact Plating: Gold; Contact Material: Bronze; Housing Color: Black; Material: Bronze; Housing Material: Thermoplastic; Min Operating Temperature: -40°C; Max Operating Temperature: 105°C; Number of Rows: 2; Package Quantity: 3000; Contact Gender: Male; Packaging: Bulk; Termination: SMD/SMT; Number of Contacts: 6; Orientation: Straight; Voltage Rating (DC): 250V; Series: 71308; Pitch: 2.54mm; Row Spacing: 2.54mm; ELV: Compliant; Halogen Free: Low Halogen; Lead Free: Lead Free; Flammability Rating: UL94 V-0; RoHS Compliant: Yes; Reach SVHC Compliant: Unknown; ComponentLink1URL: https://datasheet.octopart.com/15-91-0060-Molex-datasheet-164461481.pdf?src-supplier=Sager+Electronics; ComponentLink1Description: https://datasheet.octopart.com/15-91-0060-Molex-datasheet-164461481.pdf?src-supplier=Sager+Electronics; ComponentLink2URL: https://datasheet.octopart.com/15-91-0060-Molex-datasheet-154743765.pdf?src-supplier=Master+Electronics; ComponentLink2Description: https://datasheet.octopart.com/15-91-0060-Molex-datasheet-154743765.pdf?src-supplier=Master+Electronics; Supplier Part Number 1: WM17457-ND
J5 = HEADER_40PIN_SMD: Conn Unshrouded Header HDR 40 POS 2.54mm Solder ST Top Entry SMD Bulk; Manufacturer: Amphenol ICC / FCI; Manufacturer Part Number: C6332245; Current Rating: 3A; Voltage Rating: 1.5kV; Number of Positions: 40; Insulation Resistance: 5GR; Gender: Male; Row Spacing: 0.1inch; Contact Post Length: 4.7mm; Supplier 1: Digikey; RoHS: Yes; Category: Headers and Wire Housings; Stock 1: 2650; Pricing 1: 1=1.53, 10=1.296, 100=1.1013, 600=0.97043, 1200=0.92412, 5400=0.83112, 10200=0.79469 (USD); Mount: Surface Mount; Contact Plating: Tin,Gold; Contact Material: Bronze; Color: Black; Housing Color: Black; Housing Material: Thermoplastic; Min Operating Temperature: -65°C; Max Operating Temperature: 125°C; Number of Rows: 2; Contact Gender: Male; Termination: Solder; Number of Contacts: 40; Max Voltage Rating (AC): 1.5kV; Orientation: Straight; Package Quantity: 100; Packaging: Bulk; Series: BERGSTIK® II, MezzSelect™, Basics+; Contact Type: Male Pin; Length: 50.8mm; Pitch: 2.54mm; Contact Mating Length: 0.23inch; Depth: 4.83mm; Reach SVHC Compliant: No; Flammability Rating: UL94 V-0; ComponentLink1URL: https://datasheet.ciiva.com/726/95157-726825.pdf?src-supplier=Digikey; ComponentLink1Description: https://datasheet.ciiva.com/726/95157-726825.pdf?src-supplier=Digikey; ComponentLink2URL: https://datasheet.ciiva.com/10113/95157-10113738.pdf?src-supplier=Avnet; ComponentLink2Description: https://datasheet.ciiva.com/10113/95157-10113738.pdf?src-supplier=Avnet; ComponentLink3URL: https://datasheet.ciiva.com/5155/95157-101776-5155834.pdf?src-supplier=Mouser; ComponentLink3Description: https://datasheet.ciiva.com/5155/95157-101776-5155834.pdf?src-supplier=Mouser; Supplier Part Number 1: 609-3124-ND
L1 = IND2n2: Inductor with Inductance: 2.2nH Tol. +/-0.1nH, Package: 0402 (1005); MF: Murata Electronics; MP: LQW15AN2N2B80D; Package: 1006 Murata; Check_prices: https://www.snapeda.com/parts/LQW15AN2N2B80D/Murata%20Electronics%20North%20America/view-part/1522880/?ref=eda; Availability: Good; Value: *; Purchase-URL: https://pricing.snapeda.com/search/part/LQW15AN2N2B80D/?ref=eda; Price: None; SnapEDA_Link: https://www.snapeda.com/parts/LQW15AN2N2B80D/Murata%20Electronics%20North%20America/view-part/1522880/?ref=snap; Manufacturer Part Number: LQW15AN2N2B80D
L2 = SPH252010H2R2MT: Fixed Ind 2.220%UH 0.114 Ohm 1800; Manufacturer: Sunlord; Supplier 1: Digikey; Manufacturer Part Number: C315721; RoHS: Yes; Category: Fixed Inductors; Stock 1: 1953; Pricing 1: 1=0.27, 10=0.207, 25=0.1872, 50=0.1736, 100=0.1609, 250=0.14548, 500=0.13478, 1000=0.125 (USD); RoHS Compliant: Yes; Supplier Part Number 1: 3442-SPH252010H2R2MTCT-ND
L3 L4 = IND2n2: Inductor with Inductance: 2.2nH Tol. +/-0.1nH, Package: 0402 (1005); Manufacturer Part Number: C2041833; MF: Murata Electronics; MP: LQW15AN2N2B80D; Package: 1006 Murata; Check_prices: https://www.snapeda.com/parts/LQW15AN2N2B80D/Murata%20Electronics%20North%20America/view-part/1522880/?ref=eda; Availability: Good; Value: *; Purchase-URL: https://pricing.snapeda.com/search/part/LQW15AN2N2B80D/?ref=eda; Price: None; SnapEDA_Link: https://www.snapeda.com/parts/LQW15AN2N2B80D/Murata%20Electronics%20North%20America/view-part/1522880/?ref=snap
R1-R3 R5-R9 = RC0402FR-075K1L: SMD Chip Resistor, 5.1 kOhm, ï¿½ 1%, 62.5 mW, 0402 [1005 Metric], Thick Film, General Purpose; Manufacturer: Yageo; Manufacturer Part Number: C105872; Power Rating: 63mW; Voltage Rating: 50V; Resistance: 5.1kR; Temperature Coefficient: 100ppm/°C; Supplier 1: Digikey; RoHS: Yes; Category: Chip SMD Resistors; Stock 1: 868211; Pricing 1: 1=0.1, 10=0.009, 50=0.0072, 100=0.0041, 500=0.00306 (USD); Case/Package: 0402; Case Code (Metric): 1005; Case Code (Imperial): 0402; Min Operating Temperature: -55°C; Max Operating Temperature: 155°C; Tolerance: 1%; Packaging: Tape and Reel; Package Quantity: 1; Resistor Type: Thick Film; Number of Terminations: 2; Termination: SMD/SMT; Max Power Dissipation: 63mW; Features: Moisture Resistant; Series: RC; Resistance Tolerance: 1%; Technology: THICK FILM; Voltage Rating (DC): 50V; Working Voltage: 50V; Construction: Rectangular; Length: 1mm; Width: 0.02inch; Height: 0.016inch; Depth: 0.5mm; RoHS Compliant: Yes; Reach SVHC Compliant: Unknown; Lead Free: 5697LeadFree; Military Standard: Not; Supplier Part Number 1: 311-5.10KLRCT-ND; LCSC: C105872
R4 = 2K2: Res Thin Film 0402 2K Ohm 0.1% 0.063W ±25ppm/°C Molded SMD Punched Carrier T/R; Manufacturer: Panasonic; Manufacturer Part Number: ERA2AEB202X; Resistance: 2kR; Power Rating: 63mW; Voltage Rating: 25V; Supplier 1: Digikey; RoHS: Yes; Category: Chip SMD Resistors; Stock 1: 90625; Pricing 1: 1=0.1, 10=0.082, 50=0.0716, 100=0.0677, 500=0.05944, 1000=0.05637, 5000=0.05032 (USD); Mount: Surface Mount; Case/Package: 0402; Case Code (Metric): 1005; Case Code (Imperial): 0402; Contact Plating: Tin; Size Code: 0402; Min Operating Temperature: -55°C; Max Operating Temperature: 155°C; Tolerance: 0.1%; Packaging: Tape and Reel; Package Quantity: 1; Resistor Type: Thin Film,Metal Film; Number of Terminations: 2; Termination: SMD/SMT; Temperature Coefficient: 25ppm/°C; Max Power Dissipation: 63mW; Features: Automotive AEC-Q200; Series: ERA-2A; Resistance Tolerance: 0.1%; Technology: THIN FILM; Length: 1mm; Width: 0.5mm; Height: 0.35mm; Depth: 0.5mm; Radiation Hardening: No; Reach SVHC Compliant: No; Lead Free: Lead Free; RoHS Compliant: Yes; ComponentLink1URL: https://datasheet.ciiva.com/43470/1776116-43470486.pdf?src-supplier=Farnell; ComponentLink1Description: https://datasheet.ciiva.com/43470/1776116-43470486.pdf?src-supplier=Farnell; ComponentLink2URL: https://datasheet.ciiva.com/9116/aoa0000ce26-9116653.pdf?src-supplier=Avnet; ComponentLink2Description: https://datasheet.ciiva.com/9116/aoa0000ce26-9116653.pdf?src-supplier=Avnet; ComponentLink3URL: https://datasheet.ciiva.com/9197/aoa0000ce26-9197535.pdf?src-supplier=Avnet; ComponentLink3Description: https://datasheet.ciiva.com/9197/aoa0000ce26-9197535.pdf?src-supplier=Avnet; Supplier Part Number 1: P2.0KDCCT-ND
R10 = 15K0402: Res Thin Film 0402 15K Ohm 0.1% 0.063W(1/16W) ±25ppm/C Pad SMD T/R; Manufacturer: Yageo; Manufacturer Part Number: C852545; Voltage Rating: 50V; Resistance: 15kR; Power Rating: 62.5mW; Max Power Dissipation: 63mW; Temperature Coefficient: 25ppm/°C; Supplier 1: Digikey; RoHS: Yes; Category: Chip SMD Resistors; Stock 1: 36293; Pricing 1: 1=0.17, 10=0.116, 50=0.1, 100=0.0877, 500=0.06834, 1000=0.06018, 5000=0.04488 (USD); Case/Package: 0402; Case Code (Imperial): 0402; Case Code (Metric): 1005; Size Code: 0402; Min Operating Temperature: -55°C; Max Operating Temperature: 155°C; Tolerance: 0.1%; Number of Terminations: 2; Termination: SMD/SMT; Voltage Rating (DC): 50V; Features: Moisture Resistant; Packaging: Tape and Reel; Package Quantity: 10000; Series: RT; Length: 0.039inch; Width: 0.02inch; Height: 0.014inch; Lead Free: Lead Free; RoHS Compliant: Yes; ComponentLink1URL: https://datasheet.ciiva.com/2582/pyu-rt-1-to-0-05-rohs-l-5-2582151.pdf?src-supplier=Digikey; ComponentLink1Description: https://datasheet.ciiva.com/2582/pyu-rt-1-to-0-05-rohs-l-5-2582151.pdf?src-supplier=Digikey; ComponentLink2URL: https://datasheet.ciiva.com/12723/pyu-rt-1-to-0-05-rohs-l-4-12723782.pdf?src-supplier=Mouser; ComponentLink2Description: https://datasheet.ciiva.com/12723/pyu-rt-1-to-0-05-rohs-l-4-12723782.pdf?src-supplier=Mouser; Supplier Part Number 1: YAG2302CT-ND
R11 = 33K0402: SMD Chip Resistor, 33 Kohm, ½ 5%, 62.5 Mw, 0402 [1005 Metric], Thick Film, General Purpose; Manufacturer: Yageo; Manufacturer Part Number: C138003; Resistance: 33kR; Power Rating: 62.5mW; Voltage Rating: 50V; Temperature Coefficient: 100ppm/°C; Max Power Dissipation: 63mW; Supplier 1: Digikey; RoHS: Yes; Category: Chip SMD Resistors; Stock 1: 242382; Pricing 1: 1=0.1, 10=0.007, 50=0.0066, 100=0.0061, 500=0.0051, 1000=0.00408, 5000=0.00306 (USD); Case/Package: 0402; Case Code (Imperial): 0402; Case Code (Metric): 1005; Min Operating Temperature: -55°C; Max Operating Temperature: 155°C; Tolerance: 5%; Packaging: Tape and Reel; Termination: SMD/SMT; Resistor Type: Thick Film; Number of Terminations: 2; Features: Moisture Resistant; Series: RC; Resistance Tolerance: 5%; Voltage Rating (AC): 50V; Working Voltage: 50V; Construction: Rectangular; Technology: THICK FILM; Length: 1mm; Depth: 0.5mm; Reach SVHC Compliant: No; Lead Free: Lead Free; RoHS Compliant: Yes; Military Standard: Not; ComponentLink1URL: https://datasheet.ciiva.com/16740/pyu-rc0402-51-rohs-l-6-r-16740743.pdf?src-supplier=Future+Electronics; ComponentLink1Description: https://datasheet.ciiva.com/16740/pyu-rc0402-51-rohs-l-6-r-16740743.pdf?src-supplier=Future+Electronics; ComponentLink2URL: https://datasheet.ciiva.com/7983/1018594-7983578.pdf?src-supplier=Element14; ComponentLink2Description: https://datasheet.ciiva.com/7983/1018594-7983578.pdf?src-supplier=Element14; ComponentLink3URL: https://datasheet.ciiva.com/7850/1018594-7850198.pdf?src-supplier=Element14; ComponentLink3Description: https://datasheet.ciiva.com/7850/1018594-7850198.pdf?src-supplier=Element14; ComponentLink4URL: https://datasheet.ciiva.com/7850/1018594-7850199.pdf?src-supplier=Element14; ComponentLink4Description: https://datasheet.ciiva.com/7850/1018594-7850199.pdf?src-supplier=Element14; ComponentLink5URL: https://datasheet.ciiva.com/5558/pyu-rc0402-51-rohs-l-6-r-5558154.pdf?src-supplier=Mouser; ComponentLink5Description: https://datasheet.ciiva.com/5558/pyu-rc0402-51-rohs-l-6-r-5558154.pdf?src-supplier=Mouser; Supplier Part Number 1: 311-33KJRCT-ND
S1 S2 = SW_P: Switch Tactile N.O. SPST Round Button Gull Wing 0.05A 12VDC 0.98N SMD T/R; Manufacturer: Alps Electric; Manufacturer Part Number: C202388; Supplier 1: Digikey; RoHS: Yes; Category: Tactile Switches; Stock 1: 19659; Pricing 1: 1=0.41, 10=0.351, 25=0.3276, 100=0.2931, 250=0.27156, 500=0.2563, 1000=0.24208 (USD); RoHS Compliant: Yes; ComponentLink1URL: http://datasheet.octopart.com/SKRKAHE020-ALPS-datasheet-41327033.pdf?src-supplier=Farnell; ComponentLink1Description: http://datasheet.octopart.com/SKRKAHE020-ALPS-datasheet-41327033.pdf?src-supplier=Farnell; ComponentLink2URL: http://datasheet.octopart.com/SKRKAHE020-ALPS-datasheet-41327033.pdf?src-supplier=Avnet; ComponentLink2Description: http://datasheet.octopart.com/SKRKAHE020-ALPS-datasheet-41327033.pdf?src-supplier=Avnet; ComponentLink3URL: http://datasheet.octopart.com/SKRKAHE020-ALPS-datasheet-41327033.pdf?src-supplier=Onlinecomponents.com; ComponentLink3Description: http://datasheet.octopart.com/SKRKAHE020-ALPS-datasheet-41327033.pdf?src-supplier=Onlinecomponents.com; ComponentLink4URL: http://datasheet.octopart.com/SKRKAHE020-ALPS-datasheet-41327033.pdf?src-supplier=Verical; ComponentLink4Description: http://datasheet.octopart.com/SKRKAHE020-ALPS-datasheet-41327033.pdf?src-supplier=Verical; ComponentLink5URL: http://datasheet.octopart.com/SKRKAHE020-ALPS-datasheet-41327033.pdf?src-supplier=Future+Electronics; ComponentLink5Description: http://datasheet.octopart.com/SKRKAHE020-ALPS-datasheet-41327033.pdf?src-supplier=Future+Electronics; ComponentLink6URL: https://datasheet.octopart.com/SKRKAHE020-ALPS-datasheet-156009340.pdf?src-supplier=Electro+Sonic; ComponentLink6Description: https://datasheet.octopart.com/SKRKAHE020-ALPS-datasheet-156009340.pdf?src-supplier=Electro+Sonic; ComponentLink7URL: http://datasheet.octopart.com/SKRKAHE020-ALPS-datasheet-41327033.pdf?src-supplier=Quest; ComponentLink7Description: http://datasheet.octopart.com/SKRKAHE020-ALPS-datasheet-41327033.pdf?src-supplier=Quest; ComponentLink8URL: https://datasheet.octopart.com/SKRKAHE020-ALPS-datasheet-41327033.pdf?src-supplier=Master+Electronics; ComponentLink8Description: https://datasheet.octopart.com/SKRKAHE020-ALPS-datasheet-41327033.pdf?src-supplier=Master+Electronics; Supplier Part Number 1: 4809-SKRKAHE020CT-ND
U1 = USBLC6-2SC6: ESD Suppressor Diode Array Dual Uni-Dir 15kV Air Gap/15kV Contact Disc 6-Pin SOT-23 T/R; Manufacturer: STMicroelectronics; Manufacturer Part Number: C7519; Data Rate: 480Mbps; Direction: Unidirectional,Bidirectional; Capacitance: 3.5pF; Operating Supply Voltage: 1.1V; Number of Elements: 1; Number of Channels: 2; Reverse Breakdown Voltage: 6V; Clamping Voltage: 17V; Working Voltage: 5V; Reverse Standoff Voltage: 5.25V; Power Line Protection: Yes; Test Current: 1mA; Max Reverse Leakage Current: 150nA; Peak Pulse Current: 5A; Supplier 1: Digikey; RoHS: Yes; Category: TVS Diodes; Stock 1: 85420; Pricing 1: 1=0.36, 10=0.243, 100=0.163, 500=0.127, 1000=0.114, 3000=0.09, 6000=0.084, 9000=0.078, 15000=0.077, 21000=0.0755, 30000=0.075 (USD); Mount: Surface Mount; Case/Package: SOT-23; Number of Pins: 6; Min Operating Temperature: -40°C; Max Operating Temperature: 125°C; Packaging: Tape and Reel; Package Quantity: 3000; Polarity: Unidirectional,Bidirectional; Breakdown Voltage: 6V; Termination: SMD/SMT; Number of Bidirectional Channels: 2; Min Breakdown Voltage: 6V; ESD Protection: Yes; Max Breakdown Voltage: 6V; Leakage Current: 150nA; Series: USB; Clamping Voltage-Max: 17V; Max Repetitive Reverse Voltage (Vrrm): 5.25V; Length: 3.05mm; Width: 1.75mm; Height: 1.3mm; Depth: 1.75mm; Radiation Hardening: No; Reach SVHC Compliant: No; Lead Free: Lead Free; RoHS Compliant: Yes; ComponentLink1URL: https://datasheet.ciiva.com/1268/1690354-1268384.pdf?src-supplier=Element14; ComponentLink1Description: https://datasheet.ciiva.com/1268/1690354-1268384.pdf?src-supplier=Element14; ComponentLink2URL: https://datasheet.ciiva.com/4508/cd00050750-113117-4508433.pdf?src-supplier=Mouser; ComponentLink2Description: https://datasheet.ciiva.com/4508/cd00050750-113117-4508433.pdf?src-supplier=Mouser; ComponentLink3URL: https://datasheet.ciiva.com/41444/001184109-da-01-en-ic-esd-protecti-usblc6-2sc6-sot-23-6-stm-41444156.pdf?src-supplier=Conrad; ComponentLink3Description: https://datasheet.ciiva.com/41444/001184109-da-01-en-ic-esd-protecti-usblc6-2sc6-sot-23-6-stm-41444156.pdf?src-supplier=Conrad; Supplier Part Number 1: 497-5235-1-ND; LCSC: C5250994
U2 = SPX3819M5-L-3-3: Linear Voltage Regulator IC Positive Fixed 1 Output 500mA SOT-23-5; Manufacturer Part Number: C9055; MF: MaxLinear, Inc.; MP: SPX3819M5-L-3-3/TR; SnapEDA_Link: https://www.snapeda.com/parts/SPX3819M5-L-3-3/TR/MaxLinear%252C+Inc./view-part/?ref=snap; Package: SOT-23-5 Exar; Value: *; Check_prices: https://www.snapeda.com/parts/SPX3819M5-L-3-3/TR/MaxLinear%252C+Inc./view-part/?ref=eda
U3 = ESP32-C3: WiFi Modules (802.11) (Engineering Samples Only) SMD IC ESP32-C3, RISC-V single-core MCU, 2.4G Wi-Fi & BLE 5.0 combo, QFN 32-pin, 5*5 mm, 40 ~ 105C; Manufacturer Part Number: C2838500; MF: Espressif Systems; SnapEDA_Link: https://www.snapeda.com/parts/ESP32-C3/Espressif+Systems/view-part/?ref=snap; Package: VFQFN-32 Espressif Systems; Value: *; MP: ESP32-C3; Check_prices: https://www.snapeda.com/parts/ESP32-C3/Espressif+Systems/view-part/?ref=eda
U4 = BMI088: High-performance 6-axis inertial sensor (accelerometer + gyroscope) <a href="https://pricing.snapeda.com/parts/BMI088/Bosch%20Sensortec/view-part?ref=eda">Check prices</a>; Manufacturer Part Number: C194919; Package: None; MP: BMI088; Value: *; Availability: Unavailable; Price: None
U5 = BMM350: No Description Available; Mfr_Name: Bosch Sensortec; Manufacturer Part Number: C17225907; Type: Magnetic Sensors; RefDes: RefDes
U6 = W25Q16JVUXIQ_TR: NOR Flash Serial (SPI, Dual SPI, Quad SPI) 3V/3.3V 16M-bit 2M x 8 6ns 8-Pin USON EP T/R; Manufacturer Part Number: C2843335; MF: Winbond; MP: W25Q16JVUXIQ TR; Purchase-URL: https://pricing.snapeda.com/search/part/W25Q16JVUXIQ TR/?ref=eda; Value: *; SnapEDA_Link: https://www.snapeda.com/parts/W25Q16JVUXIQ%20TR/Winbond/view-part/?ref=snap; Package: UFDFN-8 Winbond; Check_prices: https://www.snapeda.com/parts/W25Q16JVUXIQ%20TR/Winbond/view-part/?ref=eda; Price: None; Availability: In Stock
U7 = BME688: Gas sensor measuring relative humidity, barometric pressure, ambient temperature and gas (VOC); Manufacturer Part Number: C3664478; Package: None; MP: BME688; Price: None; Availability: Unavailable; Value: *
U8 = BMP390: No Description Available; Mfr_Name: Bosch Sensortec; Manufacturer Part Number: C2684802; RefDes: RefDes; Type: Type
U9 = SHT45-AD1B-R3: Digital Relative Humidity Temperature Sensor, Â±1.0 %RH, Â±0.1 Â°C, Ultra-Low-Power, with filtermembrane; MF: Sensirion; Availability: In Stock; Price: None; Package: Package; MP: SHT45-AD1B-R3; Value: *; SnapEDA_Link: https://www.snapeda.com/parts/SHT45-AD1B-R3/Sensirion/view-part/?ref=snap; Check_prices: https://www.snapeda.com/parts/SHT45-AD1B-R3/Sensirion/view-part/?ref=eda; Purchase-URL: https://pricing.snapeda.com/search/part/SHT45-AD1B-R3/?ref=eda; Manufacturer Part Number: SHT45-AD1B-R3
U10 = TESEO-LIV4FTR: GNSS Module Dual-Band 3V to 3.63V 18-Pin LCC T/R; Manufacturer: STMicroelectronics; Manufacturer Part Number: C6284698; Supplier 1: Digikey; RoHS: No; Stock 1: 69; Pricing 1: 1=17.14, 10=14.924, 25=14.1548, 100=13.1, 250=12.46872 (USD); Supplier Part Number 1: 497-TESEO-LIV4FTRCT-ND
Y1 = ECS-400-18-33-JGN-TR3: Manufacturer Part Number: C5765977; MF: {'manufacturer': u'ECS Inc.'}; Value: *; Price: None; Package: None; MP: ECS-400-18-33-JGN-TR3; Availability: Unavailable